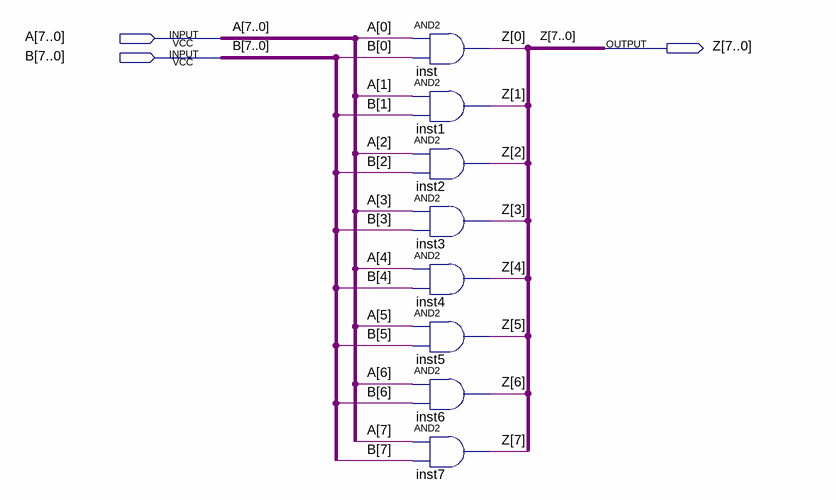
[diagram p0: schematic sheet]
// Quartus schematic bitwise_and.bdf as structural Verilog: 8 symbols, 3 pins
module bitwise_and (
  input  [7:0] A,
  input  [7:0] B,
  output [7:0] Z
);

  and inst (Z[0], A[0], B[0]);
  and inst1 (Z[1], A[1], B[1]);
  and inst2 (Z[2], A[2], B[2]);
  and inst3 (Z[3], A[3], B[3]);
  and inst4 (Z[4], A[4], B[4]);
  and inst5 (Z[5], A[5], B[5]);
  and inst6 (Z[6], A[6], B[6]);
  and inst7 (Z[7], A[7], B[7]);
endmodule
